# EAGLE schematic USBGpibV2 (EAGLE 6.6.0)
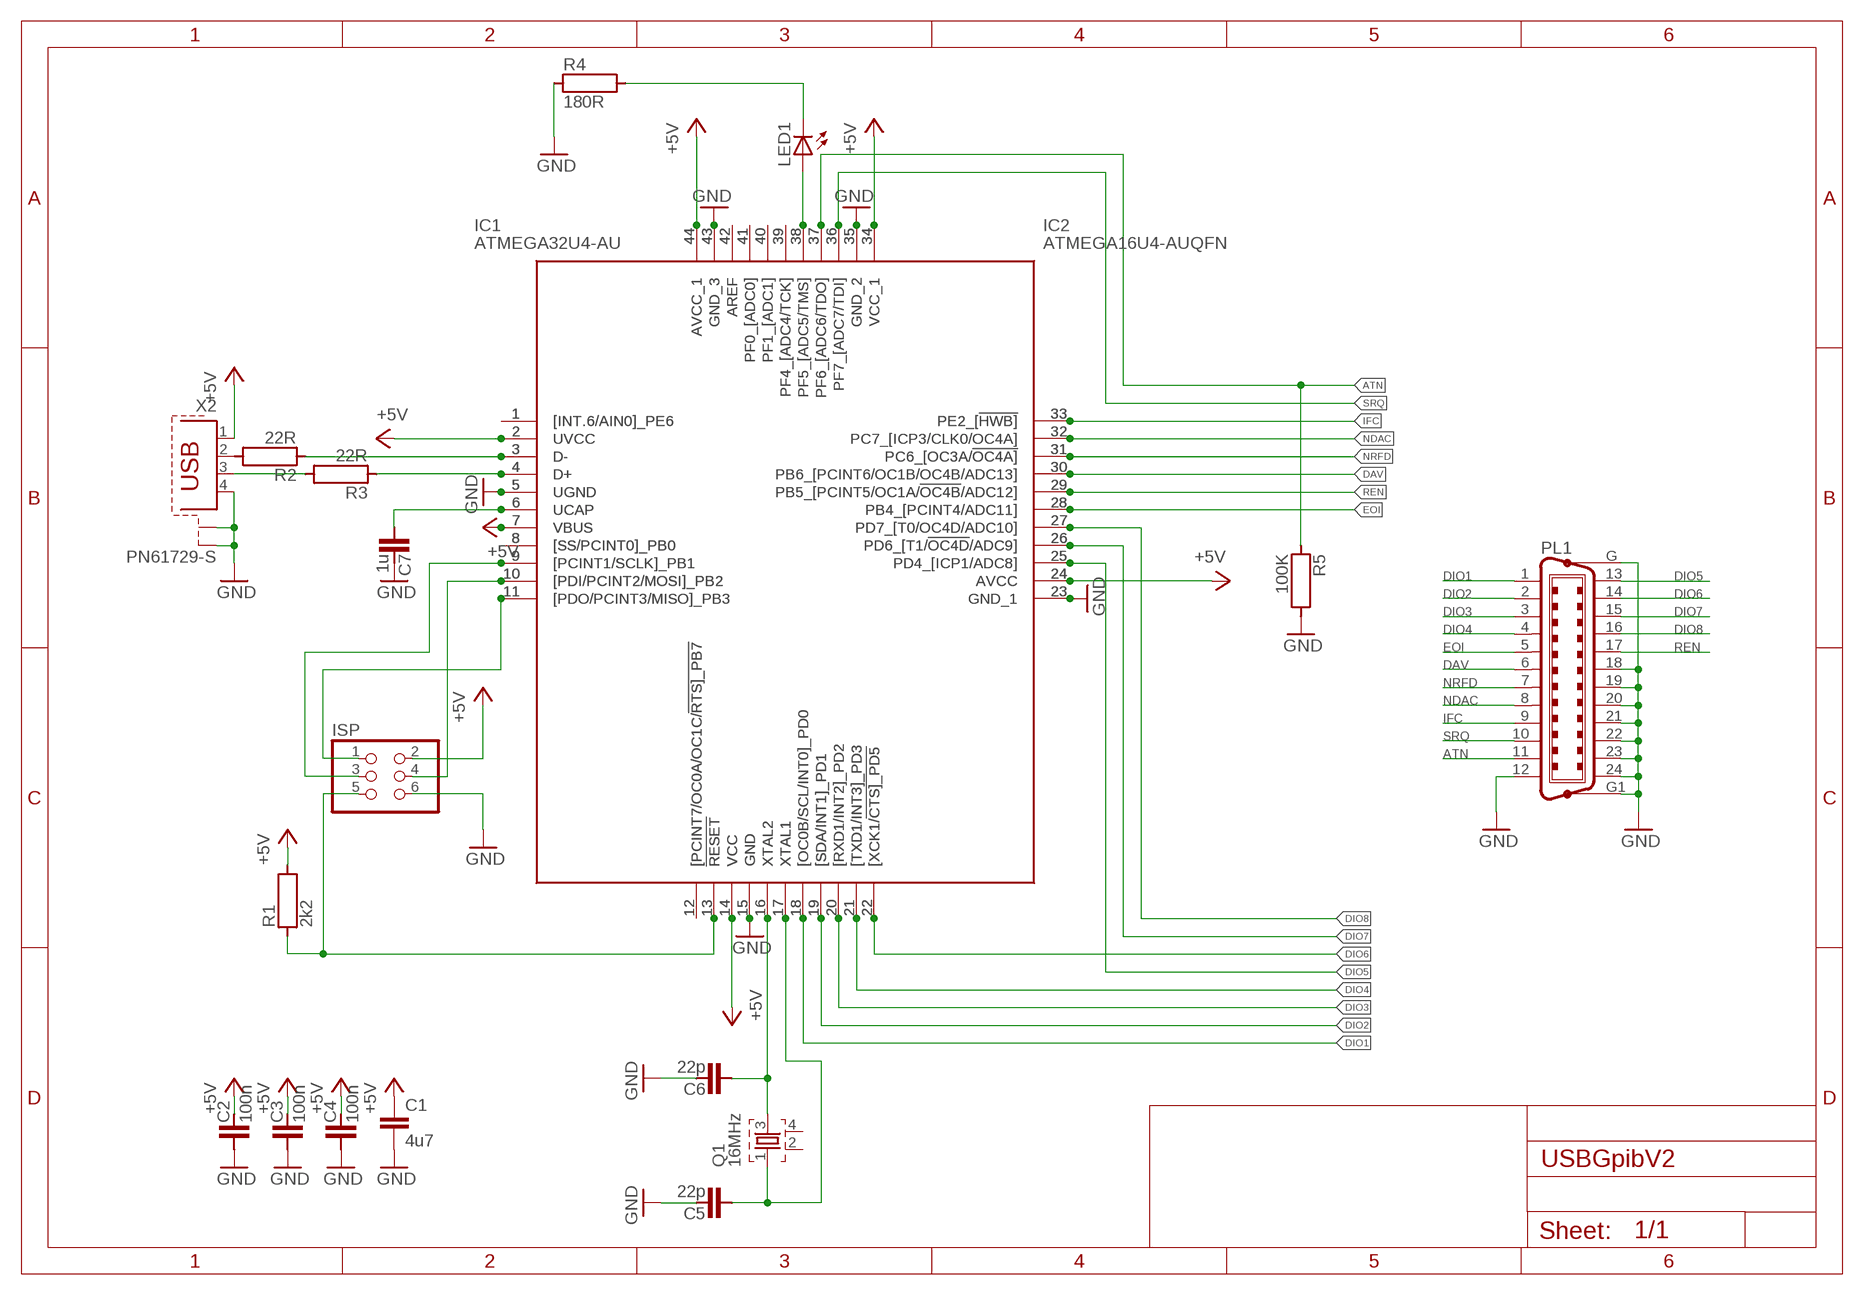
[diagram p0: schematic, sheet 1]

## Parts
C1  4u7  C-EUC1206  [C1206]
C2  100n  C0603  [C0603]
C3  100n  C0603  [C0603]
C4  100n  C0603  [C0603]
C5  22p  C0603  [C0603]
C6  22p  C0603  [C0603]
C7  1u  C0603  [C0603]
IC1  ATMEGA32U4-AU  ATMEGA16U4-AU  [QFP80P1200X1200X120-44N]
IC2  ATMEGA16U4-AUQFN  [QFN44]
ISP  PINHD-2X3  [2X03]
LED1  LEDCHIPLED_1206  [CHIPLED_1206]
PL1  C24HPMALE  [24HP_MALE]
Q1  16MHz  FA-20H  [FA-20H]
R1  2k2  R0603  [R0603]
R2  22R  R0603  [R0603]
R3  22R  R0603  [R0603]
R4  180R  R0603  [R0603]
R5  100K  R0603  [R0603]
X2  PN61729-S  [PN61729-S]

## Nets
+5V: C1.1 C2.2 C3.2 C4.2 IC1.2(UVCC) IC1.7(VBUS) IC1.14(VCC) IC1.24(AVCC) IC1.34(VCC_1) IC1.44(AVCC_1) IC2.2(UVCC) IC2.7(VBUS) IC2.14(VCC) IC2.24(AVCC) IC2.34(VCC_1) IC2.44(AVCC_1) ISP.2 R1.2 X2.1
ATN: IC1.37(PF6_[ADC6/TDO]) IC2.37(PF6_[ADC6/TDO]) PL1.11 R5.1
DAV: IC1.30(PB6_[PCINT6/OC1B/OC4B/ADC13]) IC2.30(PB6_[PCINT6/OC1B/OC4B/ADC13]) PL1.6
DIO1: IC1.18([OC0B/SCL/INT0]_PD0) IC2.18([OC0B/SCL/INT0]_PD0) PL1.1
DIO2: IC1.19([SDA/INT1]_PD1) IC2.19([SDA/INT1]_PD1) PL1.2
DIO3: IC1.20([RXD1/INT2]_PD2) IC2.20([RXD1/INT2]_PD2) PL1.3
DIO4: IC1.21([TXD1/INT3]_PD3) IC2.21([TXD1/INT3]_PD3) PL1.4
DIO5: IC1.25(PD4_[ICP1/ADC8]) IC2.25(PD4_[ICP1/ADC8]) PL1.13
DIO6: IC1.22([XCK1/!CTS]_PD5) IC2.22([XCK1/!CTS]_PD5) PL1.14
DIO7: IC1.26(PD6_[T1/!OC4D!/ADC9]) IC2.26(PD6_[T1/!OC4D!/ADC9]) PL1.15
DIO8: IC1.27(PD7_[T0/OC4D/ADC10]) IC2.27(PD7_[T0/OC4D/ADC10]) PL1.16
EOI: IC1.28(PB4_[PCINT4/ADC11]) IC2.28(PB4_[PCINT4/ADC11]) PL1.5
GND: C1.2 C2.1 C3.1 C4.1 C5.2 C6.2 C7.2 IC1.5(UGND) IC1.15(GND) IC1.23(GND_1) IC1.35(GND_2) IC1.43(GND_3) IC2.5(UGND) IC2.15(GND) IC2.23(GND_1) IC2.35(GND_2) IC2.43(GND_3) ISP.6 PL1.12 PL1.18 PL1.19 PL1.20 PL1.21 PL1.22 PL1.23 PL1.24 PL1.G PL1.G1 R4.1 R5.2 X2.4 X2.S1 X2.S2
IFC: IC1.33(PE2_[!HWB]) IC2.33(PE2_[!HWB]) PL1.9
N$1: C6.1 IC1.16(XTAL2) IC2.16(XTAL2) Q1.3
N$2: C5.1 IC1.17(XTAL1) IC2.17(XTAL1) Q1.1
N$3: C7.1 IC1.6(UCAP) IC2.6(UCAP)
N$4: R2.2 X2.2
N$5: IC1.3(D-) IC2.3(D-) R2.1
N$6: IC1.4(D+) IC2.4(D+) R3.1
N$7: R3.2 X2.3
N$8: IC1.13(!RESET) IC2.13(!RESET) ISP.5 R1.1
N$9: LED1.C R4.2
N$10: IC1.10([PDI/PCINT2/MOSI]_PB2) IC2.10([PDI/PCINT2/MOSI]_PB2) ISP.4
N$11: IC1.9([PCINT1/SCLK]_PB1) IC2.9([PCINT1/SCLK]_PB1) ISP.3
N$12: IC1.11([PDO/PCINT3/MISO]_PB3) IC2.11([PDO/PCINT3/MISO]_PB3) ISP.1
N$13: IC1.38(PF5_[ADC5/TMS]) IC2.38(PF5_[ADC5/TMS]) LED1.A
N$14: IC1.1([INT.6/AIN0]_PE6) IC2.1([INT.6/AIN0]_PE6)
N$15: IC1.8([SS/PCINT0]_PB0) IC2.8([SS/PCINT0]_PB0)
N$16: IC1.12([PCINT7/OC0A/OC1C/!RTS]_PB7) IC2.12([PCINT7/OC0A/OC1C/!RTS]_PB7)
N$17: IC1.42(AREF) IC2.42(AREF)
N$18: IC1.41(PF0_[ADC0]) IC2.41(PF0_[ADC0])
N$19: IC1.40(PF1_[ADC1]) IC2.40(PF1_[ADC1])
N$20: IC1.39(PF4_[ADC4/TCK]) IC2.39(PF4_[ADC4/TCK])
NDAC: IC1.32(PC7_[ICP3/CLK0/OC4A]) IC2.32(PC7_[ICP3/CLK0/OC4A]) PL1.8
NRFD: IC1.31(PC6_[OC3A/!OC4A]) IC2.31(PC6_[OC3A/!OC4A]) PL1.7
REN: IC1.29(PB5_[PCINT5/OC1A/!OC4B!/ADC12]) IC2.29(PB5_[PCINT5/OC1A/!OC4B!/ADC12]) PL1.17
SRQ: IC1.36(PF7_[ADC7/TDI]) IC2.36(PF7_[ADC7/TDI]) PL1.10
Unconnected: Q1.2 Q1.4

## Library data of the parts
C1 = rcl:C-EU: CAPACITOR, European symbol
C2-C7 = KaiLib:C
IC1 = ATMEGA16U4-AU:ATMEGA16U4-AU: 8-bit Microcontrollers - MCU 16K Flsh, 1K EEPROM 2.5K SRAM Source: Datasheet <http://www.atmel.com/images/atmel-7766-8-bit-avr-atmega16u4-32u4_summary.pdf>; DESCRIPTION: 8-bit Microcontrollers - MCU 16K Flsh, 1K EEPROM 2.5K SRAM; HEIGHT: 1.2mm; MANUFACTURER_NAME: Microchip; MANUFACTURER_PART_NUMBER: ATMEGA16U4-AU; MOUSER_PART_NUMBER: 556-ATMEGA16U4-AU; MOUSER_PRICE-STOCK: https://www.mouser.com/Search/Refine.aspx?Keyword=556-ATMEGA16U4-AU; RS_PART_NUMBER: 1773649P; RS_PRICE-STOCK: http://uk.rs-online.com/web/p/products/1773649P
IC2 = ATMEGA16U4-AU:ATMEGA16U4-AU: 8-bit Microcontrollers - MCU 16K Flsh, 1K EEPROM 2.5K SRAM Source: Datasheet <http://www.atmel.com/images/atmel-7766-8-bit-avr-atmega16u4-32u4_summary.pdf>
ISP = pinhead:PINHD-2X3: PIN HEADER
LED1 = led:LED: LED OSRAM: - CHIPLED LG R971, LG N971, LY N971, LG Q971, LY Q971, LO R971, LY R971 LH N974, LH R974 LS Q976, LO Q976, LY Q976 LO Q996 - Hyper CHIPLED LW Q18S LB Q993, LB Q99A, LB R99A - SideLED LS A670, LO A670, LY A670, LG A670, LP A670 LB A673, LV A673, LT A673, LW A673 LH A674 LY A675 LS A676, LA A676, LO A676, LY A676, LW A676 LS A679, LY A679, LG A679 - Hyper Micro SIDELED® LS Y876, LA Y876, LO Y876, LY Y876 LT Y87S - SmartLED LW L88C, LW L88S LB L89C, LB L89S, LG L890 LS L89K, LO L89K, LY L89K LS L896, LA L896, LO L896, LY L896 - TOPLED LS T670, LO T670, LY T670, LG T670, LP T670 LSG T670, LSP T670, LSY T670, LOP T670, LYG T670 LG T671, LOG T671, LSG T671 LB T673, LV T673, LT T673, LW T673 LH T674 LS T676, LA T676, LO T676, LY T676, LB T676, LH T676, LSB T676, LW T676 LB T67C, LV T67C, LT T67C, LS T67K, LO T67K, LY T67K, LW E67C LS E67B, LA E67B, LO E67B, LY E67B, LB E67C, LV E67C, LT E67C LW T67C LS T679, LY T679, LG T679 LS T770, LO T770, LY T770, LG T770, LP T770 LB T773, LV T773, LT T773, LW T773 LH T774 LS E675, LA E675, LY E675, LS T675 LS T776, LA T776, LO T776, LY T776, LB T776 LHGB T686 LT T68C, LB T68C - Hyper Mini TOPLED® LB M676 - Mini TOPLED Santana® LG M470 LS M47K, LO M47K, LY M47K Source: http://www.osram.convergy.de LUXEON: - LUMILED® LXK2-PW12-R00, LXK2-PW12-S00, LXK2-PW14-U00, LXK2-PW14-V00 LXK2-PM12-R00, LXK2-PM12-S00, LXK2-PM14-U00 LXK2-PE12-Q00, LXK2-PE12-R00, LXK2-PE12-S00, LXK2-PE14-T00, LXK2-PE14-U00 LXK2-PB12-K00, LXK2-PB12-L00, LXK2-PB12-M00, LXK2-PB14-N00, LXK2-PB14-P00, LXK2-PB14-Q00 LXK2-PR12-L00, LXK2-PR12-M00, LXK2-PR14-Q00, LXK2-PR14-R00 LXK2-PD12-Q00, LXK2-PD12-R00, LXK2-PD12-S00 LXK2-PH12-R00, LXK2-PH12-S00 LXK2-PL12-P00, LXK2-PL12-Q00, LXK2-PL12-R00 Source: www.luxeon.com KINGBRIGHT: KA-3528ASYC Source: www.kingbright.com
PL1 = con-amp-champ:C24HP: CONNECTOR
Q1 = crystal:FA-: MHz RANGE CRYSTAL UNIT Source: Epson Toyocom
R1-R5 = KaiLib:R
X2 = con-berg:PN61729-S: BERG USB connector; OC_FARNELL: unknown; OC_NEWARK: unknown